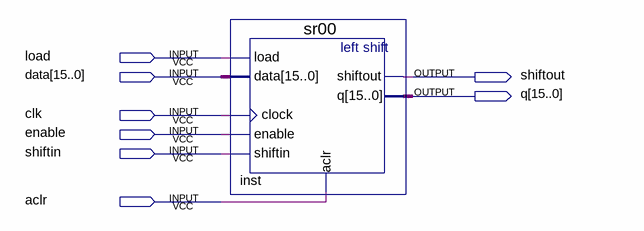
[diagram p0: schematic sheet]
// Quartus schematic b01.bdf as structural Verilog: 1 symbols, 8 pins
module b01 (
  input  load,
  input  [15:0] data,
  input  clk,
  input  enable,
  input  shiftin,
  input  aclr,
  output shiftout,
  output [15:0] q
);

  sr00 inst (
    .load(load), .data(data), .clock(clk), .enable(enable), .shiftin(shiftin), .aclr(aclr),
    .shiftout(shiftout), .q(q));
endmodule
